# Altium schematic sheet AMS1117-3.3V_C51207961_AMS1117-3.3V_C5120796.schdoc
size 124 x 101 mm
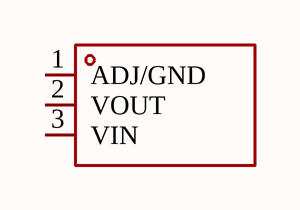
[diagram p0: AMS1117-3.3V_C51207961_AMS1117-3.3V_C5120796.schdoc]

## Parts
Q?  AMS1117-3.3V  [SOT-89-3_L4.5-W2.5-P1.50-LS4.2-BR]  (value not drawn)

## Nets

Not connected (* = marked no-connect by the designer): Q? 1(ADJ/GND) 2(VOUT) 3(VIN)

## Library data of the parts
Q? = AMS1117-3.3V_C5120796: Manufacturer: MSKSEMI(美森科); Add into BOM: yes; Output Type: 固定; Voltage - Supply: 18V; Output Voltage: 3.3V; Output Current: 1A; Voltage Dropout: 1.4V@(1A); standby current: 12mA; Output Configuration: 正极; Number of Outputs: 1; Symbol: AMS1117-3.3V_C5120796; Device: AMS1117-3.3V_C5120796; LCSC Part Name: 输入18V 输出3.3V 1A; Supplier Part: C5120796; Manufacturer Part: AMS1117-3.3V; Supplier Footprint: SOT-89; JLCPCB Part Class: Extended Part; Datasheet: https://item.szlcsc.com/datasheet/AMS1117-3.3V/5706251.html; Supplier: LCSC; Convert to PCB: yes; Operating Temperature: 0℃~+125℃